# EAGLE schematic spear (EAGLE 6.4)
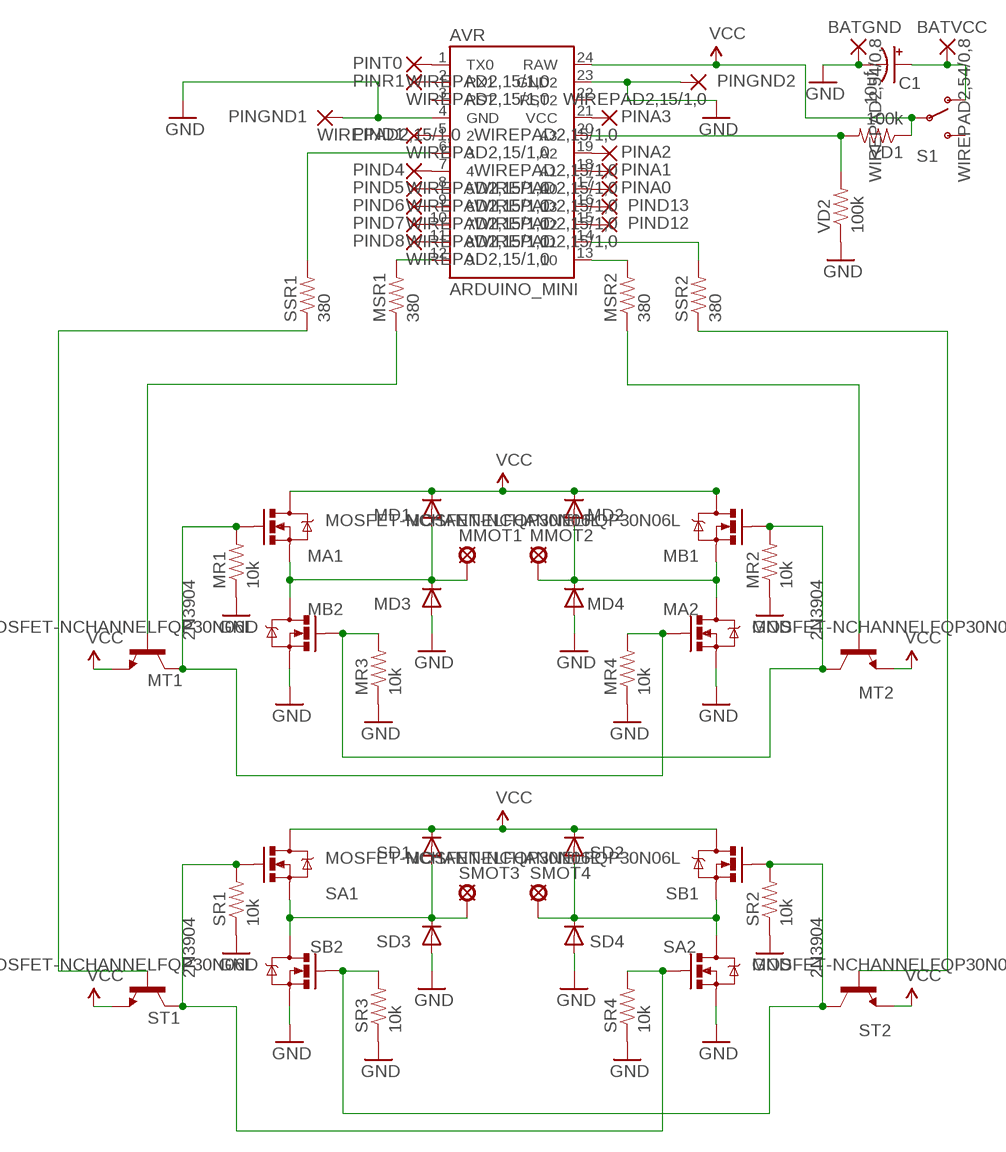
[diagram p0: schematic, sheet 1]

## Parts
AVR  ARDUINO_MINI  [ARDUINO_MINI]
BATGND  WIREPAD2,54/0,8  [2,54/0,8]
BATVCC  WIREPAD2,54/0,8  [2,54/0,8]
C1  10uf  CAP_POLPTH2  [CPOL-RADIAL-10UF-25V]
MA1  MOSFET-NCHANNELFQP30N06L  [TO220V]
MA2  MOSFET-NCHANNELFQP30N06L  [TO220V]
MB1  MOSFET-NCHANNELFQP30N06L  [TO220V]
MB2  MOSFET-NCHANNELFQP30N06L  [TO220V]
MD1  DIODEPTH  [DIODE-1N4001]
MD2  DIODEPTH  [DIODE-1N4001]
MD3  DIODEPTH  [DIODE-1N4001]
MD4  DIODEPTH  [DIODE-1N4001]
MMOT1  LSP13  [LSP13]
MMOT2  LSP13  [LSP13]
MR1  10k  RESISTORPTH-1/4W  [AXIAL-0.4]
MR2  10k  RESISTORPTH-1/4W  [AXIAL-0.4]
MR3  10k  RESISTORPTH-1/4W  [AXIAL-0.4]
MR4  10k  RESISTORPTH-1/4W  [AXIAL-0.4]
MSR1  380  RESISTORPTH-1/4W  [AXIAL-0.4]
MSR2  380  RESISTORPTH-1/4W  [AXIAL-0.4]
MT1  2N3904  [TO92]
MT2  2N3904  [TO92]
PINA0  WIREPAD2,15/1,0  [2,15/1,0]
PINA1  WIREPAD2,15/1,0  [2,15/1,0]
PINA2  WIREPAD2,15/1,0  [2,15/1,0]
PINA3  WIREPAD2,15/1,0  [2,15/1,0]
PIND1  WIREPAD2,15/1,0  [2,15/1,0]
PIND4  WIREPAD2,15/1,0  [2,15/1,0]
PIND5  WIREPAD2,15/1,0  [2,15/1,0]
PIND6  WIREPAD2,15/1,0  [2,15/1,0]
PIND7  WIREPAD2,15/1,0  [2,15/1,0]
PIND8  WIREPAD2,15/1,0  [2,15/1,0]
PIND12  WIREPAD2,15/1,0  [2,15/1,0]
PIND13  WIREPAD2,15/1,0  [2,15/1,0]
PINGND1  WIREPAD2,15/1,0  [2,15/1,0]
PINGND2  WIREPAD2,15/1,0  [2,15/1,0]
PINR1  WIREPAD2,15/1,0  [2,15/1,0]
PINT0  WIREPAD2,15/1,0  [2,15/1,0]
S1  SWITCH-SPSTPTH  [SWITCH-SPDT]
SA1  MOSFET-NCHANNELFQP30N06L  [TO220V]
SA2  MOSFET-NCHANNELFQP30N06L  [TO220V]
SB1  MOSFET-NCHANNELFQP30N06L  [TO220V]
SB2  MOSFET-NCHANNELFQP30N06L  [TO220V]
SD1  DIODEPTH  [DIODE-1N4001]
SD2  DIODEPTH  [DIODE-1N4001]
SD3  DIODEPTH  [DIODE-1N4001]
SD4  DIODEPTH  [DIODE-1N4001]
SMOT3  LSP13  [LSP13]
SMOT4  LSP13  [LSP13]
SR1  10k  RESISTORPTH-1/4W  [AXIAL-0.4]
SR2  10k  RESISTORPTH-1/4W  [AXIAL-0.4]
SR3  10k  RESISTORPTH-1/4W  [AXIAL-0.4]
SR4  10k  RESISTORPTH-1/4W  [AXIAL-0.4]
SSR1  380  RESISTORPTH-1/4W  [AXIAL-0.4]
SSR2  380  RESISTORPTH-1/4W  [AXIAL-0.4]
ST1  2N3904  [TO92]
ST2  2N3904  [TO92]
VD1  100k  RESISTORPTH-1/4W  [AXIAL-0.4]
VD2  100k  RESISTORPTH-1/4W  [AXIAL-0.4]

## Nets
GND: AVR.4(GND) AVR.23(GND2) BATGND.1(P) C1.2(-) MA2.3(S) MB2.3(S) MD3.A MD4.A MR1.P$1 MR2.P$1 MR3.P$1 MR4.P$1 PINGND1.1(P) PINGND2.1(P) SA2.3(S) SB2.3(S) SD3.A SD4.A SR1.P$1 SR2.P$1 SR3.P$1 SR4.P$1 VD2.P$1
N$1: AVR.13 MSR2.P$2
N$2: AVR.12 MSR1.P$2
N$3: AVR.6 SSR1.P$2
N$4: AVR.14 SSR2.P$2
N$5: MB1.1(G) MB2.1(G) MR2.P$2 MR3.P$2 MT2.1(C)
N$6: AVR.11 PIND8.1(P)
N$7: MSR1.P$1 MT1.2(B)
N$8: MSR2.P$1 MT2.2(B)
N$9: MA1.3(S) MB2.2(D) MD1.A MD3.C MMOT1.MP
N$10: MA2.2(D) MB1.3(S) MD2.A MD4.C MMOT2.MP
N$12: SA1.1(G) SA2.1(G) SR1.P$2 SR4.P$2 ST1.1(C)
N$13: MA1.1(G) MA2.1(G) MR1.P$2 MR4.P$2 MT1.1(C)
N$14: AVR.10 PIND7.1(P)
N$15: AVR.9 PIND6.1(P)
N$16: SB1.1(G) SB2.1(G) SR2.P$2 SR3.P$2 ST2.1(C)
N$17: AVR.8 PIND5.1(P)
N$18: AVR.7 PIND4.1(P)
N$20: AVR.15 PIND12.1(P)
N$21: AVR.16 PIND13.1(P)
N$22: SA2.2(D) SB1.3(S) SD2.A SD4.C SMOT4.MP
N$23: AVR.17(A0) PINA0.1(P)
N$24: SA1.3(S) SB2.2(D) SD1.A SD3.C SMOT3.MP
N$25: AVR.18(A1) PINA1.1(P)
N$26: AVR.19(A2) PINA2.1(P)
N$27: AVR.21(VCC) PINA3.1(P)
N$28: BATVCC.1(P) C1.1(+) S1.1(O)
N$29: AVR.5 PIND1.1(P)
N$31: AVR.2(RX1) PINR1.1(P)
N$32: AVR.1(TX0) PINT0.1(P)
PINVCC: AVR.20(A3) VD1.P$2 VD2.P$2
SSIG1: SSR1.P$1 ST1.2(B)
SSIG2: SSR2.P$1 ST2.2(B)
VCC: AVR.24(RAW) MA1.2(D) MB1.2(D) MD1.C MD2.C MT1.3(E) MT2.3(E) S1.2(P) SA1.2(D) SB1.2(D) SD1.C SD2.C ST1.3(E) ST2.3(E) VD1.P$1
Unconnected: AVR.3(RST) AVR.22(RST2) S1.3(S)

## Library data of the parts
AVR = SparkFun-Boards:ARDUINO_MINI: Arduino Pro Mini footprint
BATGND BATVCC PINA0 PINA1-PINA3 PIND1 PIND4-PIND8 PIND12 PIND13 PINGND1 PINGND2 PINR1 PINT0 = wirepad:WIREPAD: Wire PAD connect wire on PCB
C1 = SparkFun-Capacitors:CAP_POL: Capacitor Polarized These are standard SMD and PTH capacitors. Normally 10uF, 47uF, and 100uF in electrolytic and tantalum varieties. Always verify the external diameter of the through hole cap, it varies with capacity, voltage, and manufacturer. The EIA devices should be standard.
MA1 MA2 MB1 MB2 SA1 SA2 SB1 SB2 = SparkFun-DiscreteSemi:MOSFET-NCHANNEL: Common NMOSFET Parts MFG P/N Store ID Prod ID FDD8780 TRANS-09984 SI7820DN TRANS-11055 FDS6630A IC-08089 2N7002PW TRANS-11151 FQP30N06L COM-10213 TRANS-10060 BSS123LT1G TRANS-08345 BSS138 TRANS-00830 BS170 2N7000; PROD_ID: TRANS-10060
MD1-MD4 SD1-SD4 = SparkFun:DIODE: Diode These are standard reverse protection diodes and small signal diodes. SMA package can handle up to about 1A. SOD-323 can handle about 200mA. What the SOD-323 package when ordering, there are some mfgs out there that are 5-pin packages.
MMOT1 MMOT2 SMOT3 SMOT4 = solpad:LSP13: SOLDER PAD drill 1.3 mm, distributor Buerklin, 12H562
MR1-MR4 MSR1 MSR2 SR1-SR4 SSR1 SSR2 VD1 VD2 = SparkFun:RESISTOR: Resistor Basic schematic elements and footprints for 0603, 1206, and PTH resistors.
MT1 MT2 ST1 ST2 = transistor:2N3904: NPN TRANSISTOR
S1 = SparkFun:SWITCH-SPST: SPST Switch Simple slide switch. Spark Fun Electronics SKU : COM-00102

## Net classes
0 default: width 0.457 mm, drill 0.457 mm, clearance 0.457 mm